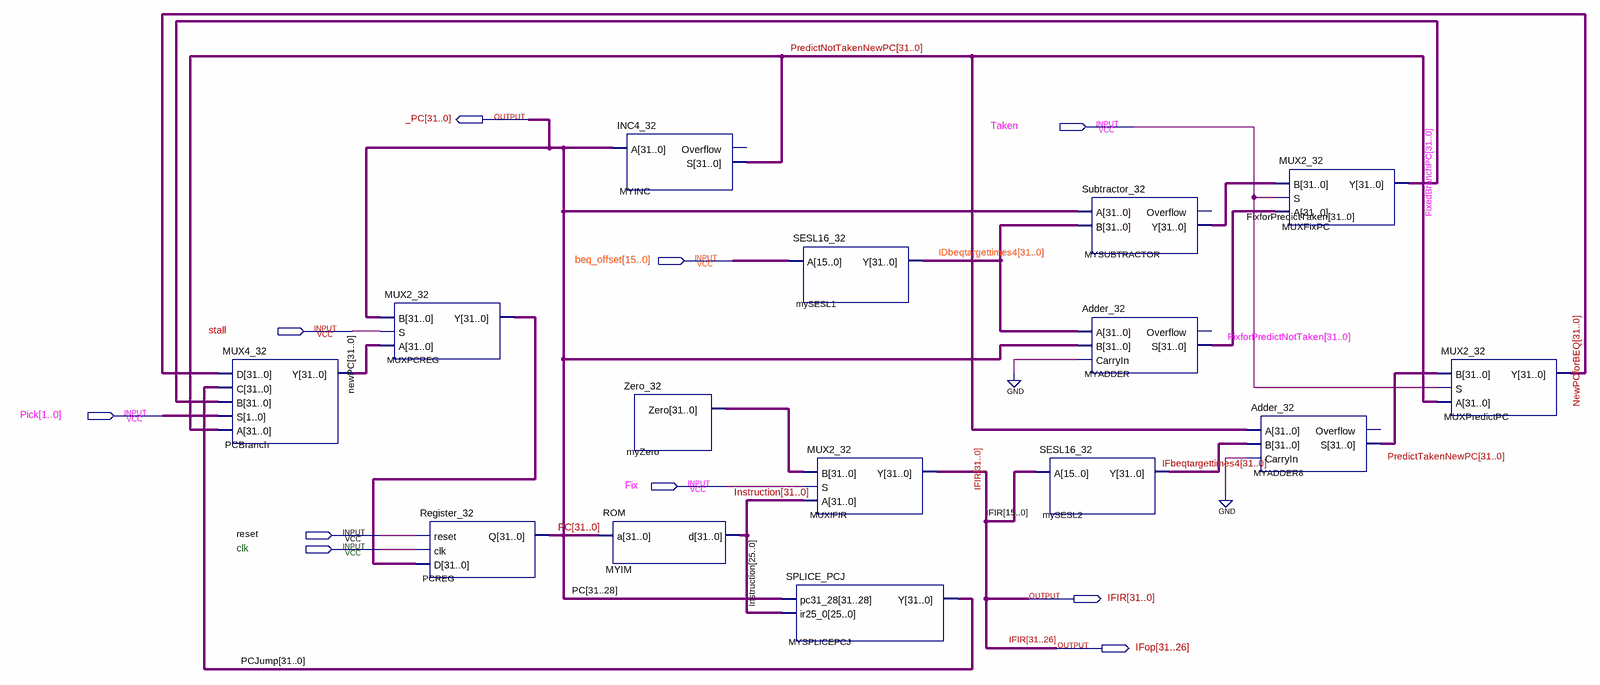
[diagram p0: schematic sheet]
// Quartus schematic IFF.bdf as structural Verilog: 15 symbols, 10 pins
module IFF (
  input  Taken,
  input  [15:0] beq_offset,
  input  stall,
  input  [1:0] Pick,
  input  Fix,
  input  reset,
  input  clk,
  output [31:0] _PC,
  output [31:0] IFIR,
  output [31:26] IFop
);

  wire [31:0] FixedBranchPC, FixforPredictNotTaken, FixforPredictTaken, IDbeqtargettimes4, IFbeqtargettimes4,
       Instruction, MUXPCREG_y, myZero_zero, newPC, NewPCforBEQ, PCJump, PredictNotTakenNewPC,
       PredictTakenNewPC;

  MUX4_32 PCBranch (.D(NewPCforBEQ), .C(PCJump), .B(FixedBranchPC), .S(Pick), .A(PredictNotTakenNewPC), .Y(newPC));
  MUX2_32 MUXPCREG (.B(_PC), .S(stall), .A(newPC), .Y(MUXPCREG_y));
  Register_32 PCREG (.reset(reset), .clk(clk), .D(MUXPCREG_y), .Q(_PC));
  INC4_32 MYINC (.A(_PC), .S(PredictNotTakenNewPC));  // open: Overflow
  Zero_32 myZero (.Zero(myZero_zero));
  ROM MYIM (.a(_PC), .d(Instruction));
  SESL16_32 mySESL1 (.A(beq_offset), .Y(IDbeqtargettimes4));
  MUX2_32 MUXIFIR (.B(myZero_zero), .S(Fix), .A(Instruction), .Y(IFIR));
  SPLICE_PCJ MYSPLICEPCJ (.pc31_28(_PC[31:28]), .ir25_0(Instruction[25:0]), .Y(PCJump));
  SESL16_32 mySESL2 (.A(IFIR[15:0]), .Y(IFbeqtargettimes4));
  Subtractor_32 MYSUBTRACTOR (.A(_PC), .B(IDbeqtargettimes4), .Y(FixforPredictTaken));  // open: Overflow
  Adder_32 MYADDER (.A(IDbeqtargettimes4), .B(_PC), .CarryIn(1'b0), .S(FixforPredictNotTaken));  // open: Overflow
  Adder_32 MYADDER8 (
    .A(PredictNotTakenNewPC), .B(IFbeqtargettimes4), .CarryIn(1'b0), .S(PredictTakenNewPC));  // open: Overflow
  MUX2_32 MUXFixPC (.B(FixforPredictTaken), .S(Taken), .A(FixforPredictNotTaken), .Y(FixedBranchPC));
  MUX2_32 MUXPredictPC (.B(PredictTakenNewPC), .S(Taken), .A(PredictNotTakenNewPC), .Y(NewPCforBEQ));

  assign IFop = IFIR[31:26];

  // Other names for the same wires on the sheet: PC[31:0] = _PC
endmodule
